# EAGLE design dcf77_clock (EAGLE 9.6.2)
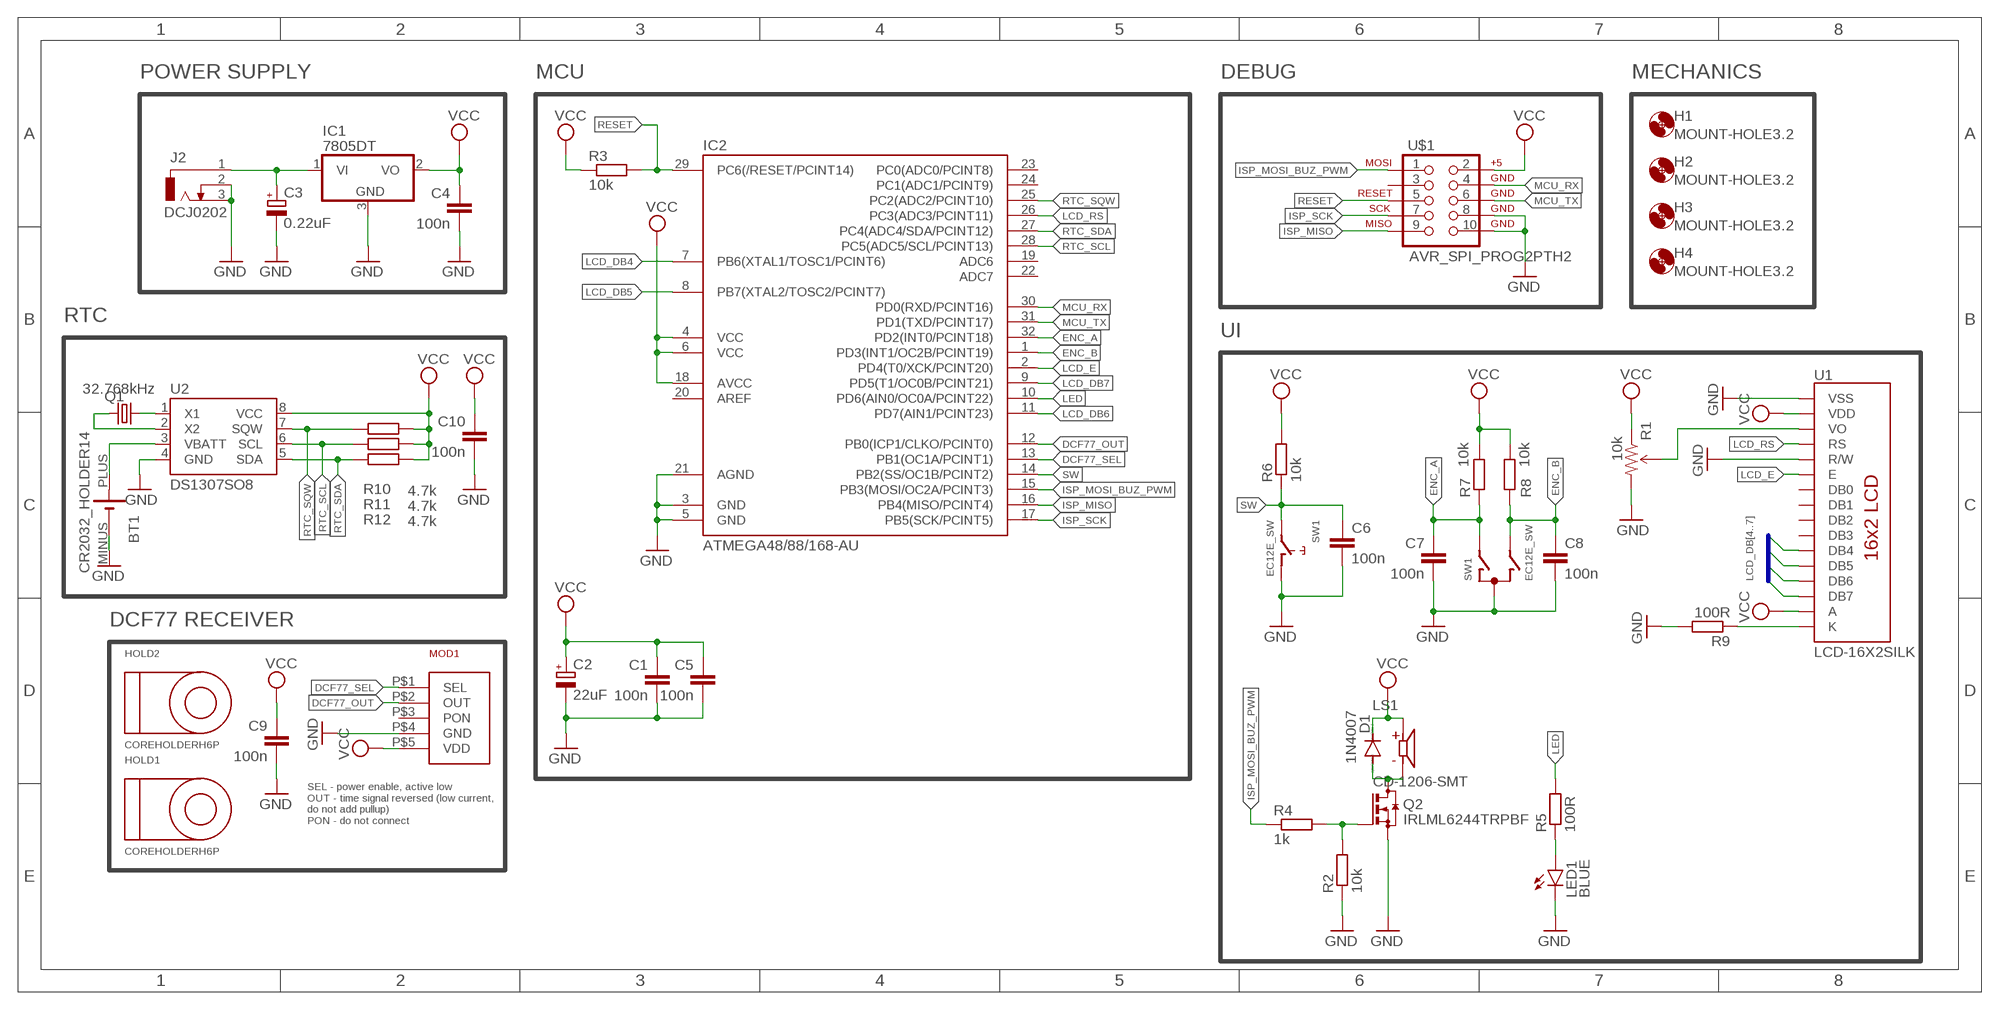
[diagram p0: schematic, sheet 1]

## Parts
BT1  CR2032_HOLDER14  [CONNFLY-DS1092-14-B6P]
C1  100n  C-EUC0805K  [C0805K]
C2  22uF  CPOL-EUUD-4X5,8  [UD-4X5,8_NICHICON]
C3  0.22uF  CPOL-EUSMCZ  [SMC_Z]
C4  100n  C-EUC0805K  [C0805K]
C5  100n  C-EUC0805K  [C0805K]
C6  100n  C-EUC0805K  [C0805K]
C7  100n  C-EUC0805K  [C0805K]
C8  100n  C-EUC0805K  [C0805K]
C9  100n  C-EUC0805K  [C0805K]
C10  100n  C-EUC0805K  [C0805K]
D1  1N4007  DIODE-SOD123  [SOD123]
H1  MOUNT-HOLE3.2  [3,2]
H2  MOUNT-HOLE3.2  [3,2]
H3  MOUNT-HOLE3.2  [3,2]
H4  MOUNT-HOLE3.2  [3,2]
HOLD1  COREHOLDERH6P  [H6P]
HOLD2  COREHOLDERH6P  [H6P]
IC1  7805DT  [TO252]
IC2  ATMEGA48/88/168-AU  [TQFP32-08]
J2  DCJ0202  [DCJ0202]
LED1  BLUE  LEDCHIP-LED0805  [CHIP-LED0805]
LS1  CD-1206-SMT  [CUI_CD-1206-SMT]
MOD1  DCF77MODULE  [DCF77MOD]
Q1  32.768kHz  CRYSTALMM20SS  [MM20SS]
Q2  IRLML6244TRPBF  [SOT23]
R1  10k  TRIMPOTPTH  [TRIM_POT_PTH]
R2  10k  R-EU_M0805  [M0805]
R3  10k  R-EU_M0805  [M0805]
R4  1k  R-EU_M0805  [M0805]
R5  100R  R-EU_M0805  [M0805]
R6  10k  R-EU_M0805  [M0805]
R7  10k  R-EU_M0805  [M0805]
R8  10k  R-EU_M0805  [M0805]
R9  100R  R-EU_M0805  [M0805]
R10  4.7k  R-EU_M0805  [M0805]
R11  4.7k  R-EU_M0805  [M0805]
R12  4.7k  R-EU_M0805  [M0805]
SW1  EC12E_SW  [ALPS_EC12E_SW]
U1  LCD-16X2SILK  [LCD-16X2]
U2  DS1307SO8  [SO08]
U$1  AVR_SPI_PROG2PTH2  [2X5-SHROUDED]

## Nets
DCF77_OUT: IC2.12(PB0(ICP1/CLKO/PCINT0)) MOD1.P$2(OUT)
DCF77_SEL: IC2.13(PB1(OC1A/PCINT1)) MOD1.P$1(SEL)
ENC_A: C7.1 IC2.32(PD2(INT0/PCINT18)) R7.1 SW1.A
ENC_B: C8.1 IC2.1(PD3(INT1/OC2B/PCINT19)) R8.1 SW1.B
GND: BT1.MINUS C1.2 C2.- C3.- C4.2 C5.2 C6.2 C7.2 C8.2 C9.2 C10.2 IC1.3(GND) IC2.3(GND) IC2.5(GND) IC2.21(AGND) J2.2 J2.3 LED1.C MOD1.P$4(GND) Q2.2(S) R1.3(CW) R2.1 R9.2 SW1.C SW1.D U1.1(VSS) U1.5(R/W) U2.4(GND) U$1.8 U$1.10
ISP_MISO: IC2.16(PB4(MISO/PCINT4)) U$1.9
ISP_MOSI_BUZ_PWM: IC2.15(PB3(MOSI/OC2A/PCINT3)) R4.1 U$1.1
ISP_SCK: IC2.17(PB5(SCK/PCINT5)) U$1.7
LCD_DB4: IC2.7(PB6(XTAL1/TOSC1/PCINT6)) U1.11(DB4)
LCD_DB5: IC2.8(PB7(XTAL2/TOSC2/PCINT7)) U1.12(DB5)
LCD_DB6: IC2.11(PD7(AIN1/PCINT23)) U1.13(DB6)
LCD_DB7: IC2.9(PD5(T1/OC0B/PCINT21)) U1.14(DB7)
LCD_E: IC2.2(PD4(T0/XCK/PCINT20)) U1.6(E)
LCD_RS: IC2.26(PC3(ADC3/PCINT11)) U1.4(RS)
LED: IC2.10(PD6(AIN0/OC0A/PCINT22)) R5.2
MCU_RX: IC2.30(PD0(RXD/PCINT16)) U$1.4
MCU_TX: IC2.31(PD1(TXD/PCINT17)) U$1.6
N$1: C3.+ IC1.1(VI) J2.1
N$2: D1.A LS1.M Q2.3(D)
N$3: Q2.1(G) R2.2 R4.2
N$4: LED1.A R5.1
N$7: R1.2(WIPER) U1.3(VO)
N$9: R9.1 U1.16(K)
N$10: Q1.1 U2.1(X1)
N$11: Q1.4 U2.2(X2)
N$12: BT1.PLUS U2.3(VBATT)
RESET: IC2.29(PC6(/RESET/PCINT14)) R3.2 U$1.5
RTC_SCL: IC2.28(PC5(ADC5/SCL/PCINT13)) R11.2 U2.6(SCL)
RTC_SDA: IC2.27(PC4(ADC4/SDA/PCINT12)) R12.2 U2.5(SDA)
RTC_SQW: IC2.25(PC2(ADC2/PCINT10)) R10.2 U2.7(SQW)
SW: C6.1 IC2.14(PB2(SS/OC1B/PCINT2)) R6.1 SW1.E
VCC: C1.1 C2.+ C4.1 C5.1 C9.1 C10.1 D1.C IC1.2(VO) IC2.4(VCC) IC2.6(VCC) IC2.18(AVCC) LS1.P MOD1.P$5(VDD) R1.1(CCW) R3.1 R6.2 R7.2 R8.2 R10.1 R11.1 R12.1 U1.2(VDD) U1.15(A) U2.8(VCC) U$1.2
Unconnected: IC2.19(ADC6) IC2.20(AREF) IC2.22(ADC7) IC2.23(PC0(ADC0/PCINT8)) IC2.24(PC1(ADC1/PCINT9)) MOD1.P$3(PON) SW1.GND1(G) SW1.GND2(G) U1.7(DB0) U1.8(DB1) U1.9(DB2) U1.10(DB3) U$1.3

## Buses
LCD_DB[4..7]

## Notes on the sheet
- POWER SUPPLY | MCU | DEBUG | MECHANICS
- RTC
- UI
- DCF77 RECEIVER
- SEL - power enable, active low
  OUT - time signal reversed (low current, 
  do not add pullup)
  PON - do not connect

## Library data of the parts
BT1 = dcf77:CR2032_HOLDER
C1 C4-C10 = rcl:C-EU: CAPACITOR, European symbol; SPICEPREFIX: C
C2 C3 = rcl:CPOL-EU: POLARIZED CAPACITOR, European symbol; SPICEPREFIX: C
D1 = diode:DIODE-: DIODE
H1-H4 = holes:MOUNT-HOLE: MOUNTING HOLE with drill center marker
HOLD1 HOLD2 = dcf77:COREHOLDER
IC1 = linear:78*: Positive VOLTAGE REGULATOR Source: http://cache.national.com/ds/LM/LM78L05.pdf http://www.fairchildsemi.com/ds/LM/LM7805.pdf
IC2 = atmega8:ATMEGA48/88/168
J2 = con-jack:DCJ0202: DC POWER JACK Source: DCJ0202.pdf; OC_FARNELL: unknown; OC_NEWARK: unknown
LED1 = led:LED: LED OSRAM: - CHIPLED LG R971, LG N971, LY N971, LG Q971, LY Q971, LO R971, LY R971 LH N974, LH R974 LS Q976, LO Q976, LY Q976 LO Q996 - Hyper CHIPLED LW Q18S LB Q993, LB Q99A, LB R99A - SideLED LS A670, LO A670, LY A670, LG A670, LP A670 LB A673, LV A673, LT A673, LW A673 LH A674 LY A675 LS A676, LA A676, LO A676, LY A676, LW A676 LS A679, LY A679, LG A679 - Hyper Micro SIDELED® LS Y876, LA Y876, LO Y876, LY Y876 LT Y87S - SmartLED LW L88C, LW L88S LB L89C, LB L89S, LG L890 LS L89K, LO L89K, LY L89K LS L896, LA L896, LO L896, LY L896 - TOPLED LS T670, LO T670, LY T670, LG T670, LP T670 LSG T670, LSP T670, LSY T670, LOP T670, LYG T670 LG T671, LOG T671, LSG T671 LB T673, LV T673, LT T673, LW T673 LH T674 LS T676, LA T676, LO T676, LY T676, LB T676, LH T676, LSB T676, LW T676 LB T67C, LV T67C, LT T67C, LS T67K, LO T67K, LY T67K, LW E67C LS E67B, LA E67B, LO E67B, LY E67B, LB E67C, LV E67C, LT E67C LW T67C LS T679, LY T679, LG T679 LS T770, LO T770, LY T770, LG T770, LP T770 LB T773, LV T773, LT T773, LW T773 LH T774 LS E675, LA E675, LY E675, LS T675 LS T776, LA T776, LO T776, LY T776, LB T776 LHGB T686 LT T68C, LB T68C - Hyper Mini TOPLED® LB M676 - Mini TOPLED Santana® LG M470 LS M47K, LO M47K, LY M47K Source: http://www.osram.convergy.de LUXEON: - LUMILED® LXK2-PW12-R00, LXK2-PW12-S00, LXK2-PW14-U00, LXK2-PW14-V00 LXK2-PM12-R00, LXK2-PM12-S00, LXK2-PM14-U00 LXK2-PE12-Q00, LXK2-PE12-R00, LXK2-PE12-S00, LXK2-PE14-T00, LXK2-PE14-U00 LXK2-PB12-K00, LXK2-PB12-L00, LXK2-PB12-M00, LXK2-PB14-N00, LXK2-PB14-P00, LXK2-PB14-Q00 LXK2-PR12-L00, LXK2-PR12-M00, LXK2-PR14-Q00, LXK2-PR14-R00 LXK2-PD12-Q00, LXK2-PD12-R00, LXK2-PD12-S00 LXK2-PH12-R00, LXK2-PH12-S00 LXK2-PL12-P00, LXK2-PL12-Q00, LXK2-PL12-R00 Source: www.luxeon.com KINGBRIGHT: KA-3528ASYC Source: www.kingbright.com
LS1 = CD-1206-SMT:CD-1206-SMT; AVAILABILITY: Unavailable; CUI_PURCHASE_URL: https://www.cui.com/product/audio/buzzers/audio-transducers/cd-1206-smt-tr?utm_source=snapeda.com&utm_medium=referral&utm_campaign=snapedaBOM; DESCRIPTION: 12 mm, 5 V, 85 dB, Surface Mount _SMT_, Sealed, Magnetic Audio Transducer Buzzer; MF: CUI Inc.; MP: CD-1206-SMT-TR; PACKAGE: 1206 CUI; PRICE: None
MOD1 = dcf77:DCF77MODULE
Q1 = crystal:CRYSTAL: CRYSTAL; OC_FARNELL: unknown; OC_NEWARK: unknown
Q2 = sosbutton:IRLML6244TRPBF: N-CHANNEL MOS FET
R1 = SparkFun:TRIMPOT
R2-R12 = rcl:R-EU_: RESISTOR, European symbol; SPICEPREFIX: R
SW1 = switch-alps:EC12E_SW: ALPS rotary Encoder EC12E series with switch; MPN: EC12E2424407; OC_FARNELL: 1520813; OC_NEWARK: 74M1068
U1 = SparkFun:LCD-16X2
U2 = SparkFun:DS1307
U$1 = SparkFun:AVR_SPI_PROG2: AVR ICSP Header This is the standard AVR In Circuit Serial Programming header. Minimal, but includes pin one indicator. Works with standard Olimex programmers. Also look for the 6-pin reduced version. Spark Fun Electronics SKU: PRT-00778

## Board
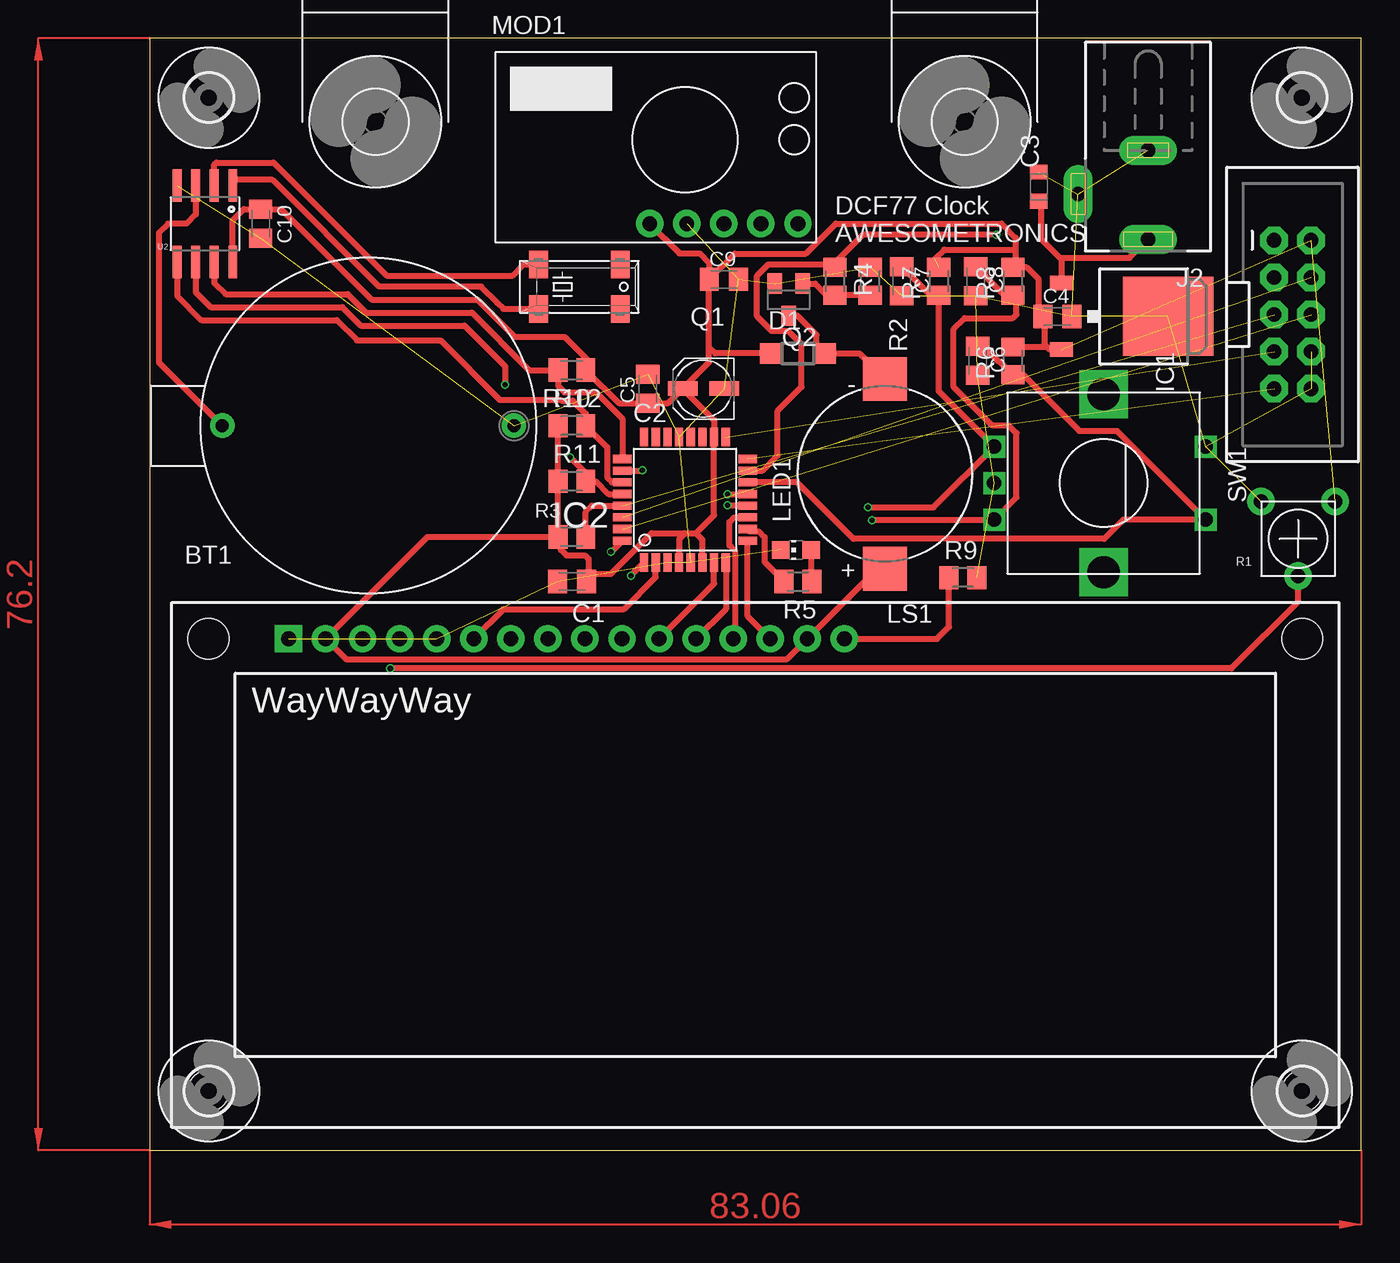
[diagram p1: board, top side]
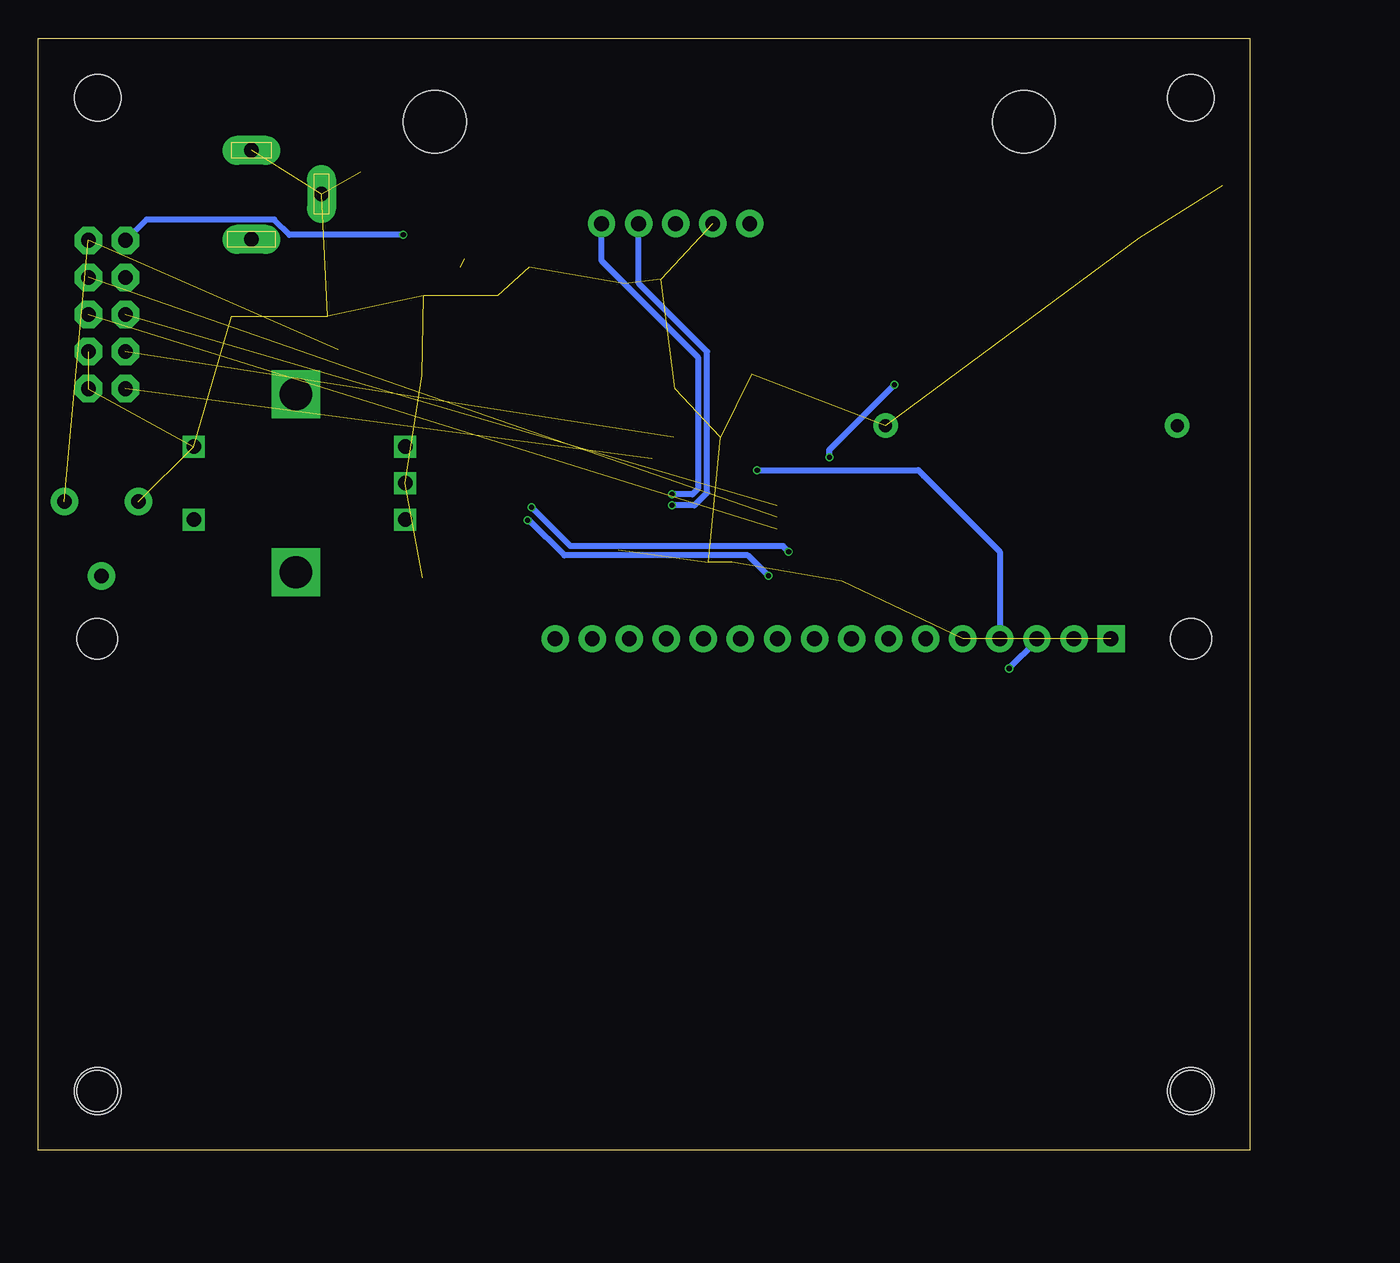
[diagram p2: board, bottom side, seen from below]

Size 83.06 x 76.2 mm. Coordinates in mm from the lower left corner, seen from the top.
Outline: 0,0 83.06,0 83.06,76.2 0,76.2 0,0
Copper layers (1*16): Top 0.035mm / dielectric 1.5mm / Bottom 0.035mm
Design rules "PCBWay_2L_152um-Track": minimum track width 6mil, minimum drill 0.3mm, track to track 6mil, track to pad 6mil, pad to pad 6mil, via to via 6mil, smd to smd 0mil, copper to edge 0.3mm, drill to drill 10mil, minimum pad ring 6mil, minimum via ring 0.1mm, stop-mask expansion 2mil, vias tented up to drill 0.45mm, thermal gap 0.2mm

### Footprints (pad centres in the part's own frame; a part is rotated, then mirrored left to right if it is on the bottom)
CONNFLY-DS1092-14-B6P = drill 0.9 pad 1.676: MINUS -10,0; PLUS 10,0
C0805K = smd 1.3 x 1.6: 1 -1,0; 2 1,0
UD-4X5,8_NICHICON = smd 2 x 1: + 1.425,0; - -1.425,0
SMC_Z = smd 1 x 1.2: + -1,0; - 1,0
SOD123 = smd 1.4 x 1.4: A 1.9,0; C -1.9,0
3,2 = hole 3.2: 0,0
H6P = hole 4.3: 0,0
TO252 = smd 1 x 1.6: 1 -2.28,-4.8; 2 2.28,-4.8 | smd 5.4 x 6.2: 3 0,2.5
TQFP32-08 = smd 1.27 x 0.559: 1 -4.293,2.8; 2 -4.293,2; 3 -4.293,1.2; 4 -4.293,0.4; 5 -4.293,-0.4; 6 -4.293,-1.2; 7 -4.293,-2; 8 -4.293,-2.8; 17 4.293,-2.8; 18 4.293,-2; 19 4.293,-1.2; 20 4.293,-0.4; 21 4.293,0.4; 22 4.293,1.2; 23 4.293,2; 24 4.293,2.8 | smd 0.559 x 1.27: 9 -2.8,-4.293; 10 -2,-4.293; 11 -1.2,-4.293; 12 -0.4,-4.293; 13 0.4,-4.293; 14 1.2,-4.293; 15 2,-4.293; 16 2.8,-4.293; 25 2.8,4.293; 26 2,4.293; 27 1.2,4.293; 28 0.4,4.293; 29 -0.4,4.293; 30 -1.2,4.293; 31 -2,4.293; 32 -2.8,4.293
DCJ0202 = drill 1 pad 2 long: 1 0,3.1; 2 4.8,0; 3 0,-3
CHIP-LED0805 = smd 1.2 x 1.2: A 0,-1.05; C 0,1.05
CUI_CD-1206-SMT = smd 3 x 3: M 0,-6.5; P 0,6.5
DCF77MOD = drill 1.016 pad 1.88: P$1 0,0; P$2 -2.54,0; P$3 -5.08,0; P$4 -7.62,0; P$5 -10.16,0
MM20SS = smd 1.27 x 1.88: 1 -2.794,-1.524; 2 2.794,-1.524; 3 2.794,1.524; 4 -2.794,1.524
SOT23 = smd 1 x 1.4: 1 -0.95,-1.1; 2 0.95,-1.1; 3 0,1.1
TRIM_POT_PTH = drill 1 pad 1.88: 1 -2.54,-2.54; 2 0,2.54; 3 2.54,-2.54
M0805 = smd 1.3 x 1.6: 1 -0.95,0; 2 0.95,0
ALPS_EC12E_SW = drill 1 square: A -2.5,-7.5; B 2.5,-7.5; C 0,-7.5; D -2.5,7; E 2.5,7 | drill 2.2 square: GND1 -6.1,0; GND2 6.1,0
LCD-16X2 = drill 1.016 pad 1.88 square: 1 -32,15.5 | drill 1.016 pad 1.88: 2 -29.46,15.5; 3 -26.92,15.5; 4 -24.38,15.5; 5 -21.84,15.5; 6 -19.3,15.5; 7 -16.76,15.5; 8 -14.22,15.5; 9 -11.68,15.5; 10 -9.14,15.5; 11 -6.6,15.5; 12 -4.06,15.5; 13 -1.52,15.5; 14 1.02,15.5; 15 3.56,15.5; 16 6.1,15.5 | hole 2.8: -37.5,15.5; -37.5,-15.5; 37.5,15.5; 37.5,-15.5
SO08 = smd 0.61 x 2.21: 1 -1.905,-2.616; 2 -0.635,-2.616; 3 0.635,-2.616; 4 1.905,-2.616; 5 1.905,2.616; 6 0.635,2.616; 7 -0.635,2.616; 8 -1.905,2.616
2X5-SHROUDED = drill 1.016 pad 1.88 octagon: 1 -1.27,5.08; 2 1.27,5.08; 3 -1.27,2.54; 4 1.27,2.54; 5 -1.27,0; 6 1.27,0; 7 -1.27,-2.54; 8 1.27,-2.54; 9 -1.27,-5.08; 10 1.27,-5.08

### Placement (x,y rotation side)
BT1  14.99,49.66 180 top
C1  28.96,38.99 180 top
C2  37.97,52.2 180 top
C3  60.96,66.04 90 top
C4  62.23,57.15 0 top
C5  34.16,52.2 90 top
C6  56.77,54.1 270 top
C7  51.56,59.56 270 top
C8  56.64,59.56 270 top
C9  39.37,59.69 0 top
C10  7.62,63.5 270 top
D1  44.45,54.61 0 top
H1  4.06,72.14 0 top
H2  4.06,4.06 0 top
H3  78.99,4.06 0 top
H4  78.99,72.14 0 top
HOLD1  15.49,70.48 270 top
HOLD2  55.88,70.48 270 top
IC1  67.31,57.15 270 top
IC2  36.7,44.58 90 top
J2  68.45,65.53 180 top
LED1  44.32,41.15 90 top
LS1  50.42,46.35 180 top
MOD1  44.45,63.5 0 top
Q1  29.46,59.18 0 top
Q2  43.81,58.29 180 top
R1  78.74,41.91 180 top
R2  49.4,59.56 270 top
R3  28.96,42.04 0 top
R4  46.99,59.56 270 top
R5  44.45,38.99 180 top
R6  59.18,54.1 90 top
R7  54.1,59.56 90 top
R8  59.18,59.56 90 top
R9  55.75,39.24 0 top
R10  28.96,53.47 180 top
R11  28.96,45.85 0 top
R12  28.96,49.66 0 top
SW1  65.41,45.72 270 top
U1  41.53,19.56 0 top
U2  3.81,63.5 180 top
U$1  78.36,57.28 0 top

### Tracks (layer width: path | path; a pad name or v marks a point on that pad's centre or on a via)
DCF77_OUT  (via drill 0.35)
  Top 0.406: v39.62,44.2 40.98,44.2 IC2.12
  Bottom 0.406: MOD1.P$2 41.91,59.44 37.22,54.74 37.22,45.08 38.09,44.2 v39.62,44.2
DCF77_SEL  (via drill 0.35)
  Top 0.406: IC2.13 40.92,44.9 40.86,44.96 v39.62,44.96
  Bottom 0.406: MOD1.P$1 44.45,60.96 37.85,54.36 37.85,45.34 38.23,44.96 v39.62,44.96
ENC_A  (via drill 0.35)
  Top 0.406: C7.1 52.89,59.24 52.89,59.23 53.7,58.42 54.1,58.42 | IC2.32 31.65,41.02 v31.62,41.02 | 54.1,58.42 54.1,52.02 SW1.A 53.75,44.06 v49.24,44.06 | 54.1,58.42 R7.1
  Bottom 0.406: v31.62,41.02 32,41.4 46.58,41.4 v49.24,44.06
ENC_B  (via drill 0.35)
  Top 0.406: C8.1 58.59,58.61 R8.1 59.44,58.36 59.44,57.28 59.18,57.02 55.88,57.02 55.12,56.26 55.12,52.32 57.78,49.66 58.93,49.66 59.44,49.15 59.44,44.75 SW1.B 49.57,43.22 v49.53,43.18 | IC2.1 33.02,39.4 v33.02,39.37
  Bottom 0.406: v33.02,39.37 34.42,40.77 46.99,40.77 49.4,43.18 v49.53,43.18
GND  (29 unrouted)
ISP_MISO  (1 unrouted)
ISP_MOSI_BUZ_PWM  (via drill 0.35)
  Top 0.406: 41.03,46.62 IC2.15 42.01,46.58 43.05,47.62 43.05,50.67 44.7,52.32 44.7,55.24 43.81,56.14 42.67,56.14 41.66,57.15 41.66,59.94 42.42,60.71 46.8,60.71 R4.1 | v58.04,62.74 58.03,62.75 48.92,62.75 46.99,60.82 R4.1 | R4.1 46.99,60.64
  Bottom 0.406: v58.04,62.74 65.84,62.74 66.89,63.79 75.66,63.79 U$1.1
ISP_SCK  (1 unrouted)
LCD_DB4
  Top 0.406: U1.11 38.7,38.83 IC2.7
LCD_DB5
  Top 0.406: IC2.8 39.5,37.09 U1.12
LCD_DB6
  Top 0.406: U1.13 40.14,35.19 40.14,41.07 39.75,41.45 39.75,43.05 40.08,43.38 IC2.11
LCD_DB7
  Top 0.406: U1.14 41,36.61 IC2.9
LCD_E
  Top 0.406: U1.6 24.25,37.08 32.51,37.08 34.7,39.27 IC2.2
LCD_RS  (via drill 0.35)
  Top 0.406: IC2.26 33.75,46.58 v33.78,46.61
  Bottom 0.406: U1.4 17.15,41.02 22.35,46.23 22.54,46.42 22.73,46.61 v33.78,46.61
LED
  Top 0.406: IC2.10 41.16,42.41 41.78,42.41 42.16,42.03 42.16,40.33 R5.2
MCU_RX  (1 unrouted)
MCU_TX  (1 unrouted)
N$1
  Top 0.406: C3.+ 61.09,64.91 61.09,62.48 62.42,61.15 | IC1.1 62.51,61.06 62.42,61.15 | 62.42,61.15 67.17,61.15 J2.1
N$2
  Top 0.406: LS1.M 48.66,54.61 D1.A 45.72,55.24 45.72,55.88 44.41,57.19 Q2.3
N$3
  Top 0.406: Q2.1 45.64,59.39 46.42,58.61 R4.2 R2.2
N$4
  Top 0.406: R5.1 45.37,39.02 LED1.A
N$7  (via drill 0.35)
  Top 0.406: R1.2 78.74,37.59 74.17,33.02 v16.51,33.02
  Bottom 0.406: v16.51,33.02 14.61,34.92 U1.3
N$9
  Top 0.406: U1.16 53.98,35.06 54.8,35.88 R9.1
N$10
  Top 0.406: U2.1 5.71,66.5 8.43,66.5 15.75,59.18 22.73,59.18 23.81,58.1 23.83,58.08 24.26,57.66 Q1.1
N$11
  Top 0.406: U2.2 4.45,67.56 4.57,67.69 8.51,67.69 16.26,59.94 24.89,59.94 25.65,60.71 Q1.4
N$12
  Top 0.406: U2.3 3.17,64.14 2.54,63.5 1.27,63.5 0.64,62.87 0.64,54.01 BT1.PLUS
RESET  (1 unrouted)
  Top 0.406: R3.2 29.91,43.75 30.33,44.18 IC2.29
RTC_SCL  (via drill 0.35)
  Top 0.406: U2.6 3.17,58.8 4.19,57.78 13.21,57.78 14.48,56.52 21.59,56.52 24.38,53.72 v24.38,52.45 | 29.97,45.85 30.61,45.85 31.48,44.98 IC2.28 | R11.2 29.97,45.85 | v28.83,47.5 29.97,46.35 29.97,45.85
  Bottom 0.406: v28.83,47.5 28.83,48.01 v24.38,52.45
RTC_SDA
  Top 0.406: U2.5 1.91,58.55 3.56,56.9 12.83,56.9 14.22,55.5 19.94,55.5 24,51.44 28.17,51.44 28.22,51.38 29.01,51.38 29.91,50.48 R12.2 31.37,48.19 31.37,46.1 31.69,45.78 IC2.27
RTC_SQW
  Top 0.406: U2.7 4.45,59.44 5.21,58.67 13.59,58.67 14.86,57.4 22.1,57.4 26.04,53.47 R10.2 28.01,52.38 28.45,51.94 30.61,51.94 32.41,50.14 IC2.25
SW
  Top 0.406: C6.1 57.18,55.1 58.23,54.05 58.29,54.05 R6.1 59.89,53.15 63.73,49.31 66.32,49.31 SW1.E 66.76,43.22 65.45,41.91 48.26,41.91 44.39,45.78 IC2.14
VCC  (3 unrouted)
  Top 0.406: U2.8 5.71,63.75 6.46,64.5 C10.1 9.03,64.5 15.24,58.29 22.48,58.29 25.02,55.75 28.45,55.75 30.35,53.85 29.97,53.47 R10.1 | 29.72,53.47 R10.1 | IC2.6 37.9,41.85 37.47,42.29 | 36.7,42.29 37.47,42.29 | IC2.4 36.3,41.89 36.7,42.29 | 37.47,42.29 38.7,43.53 IC2.18 38.7,50.04 C2.+ | R10.1 32.18,51.2 C5.1 35.55,51.2 C2.+ | C2.+ 38.37,54.02 38.37,55.03 | 38.37,55.03 C9.1 | R3.1 R11.1 R12.1 | C1.1 30.1,38.99 30.1,39.5 | 30.1,39.5 31.62,39.5 34.42,42.29 36.7,42.29 | R3.1 28.19,41.85 28.19,41.15 28.57,40.77 29.84,40.77 30.1,40.51 30.1,39.5 | R3.1 19.05,42.04 U1.2 13.47,33.66 43.69,33.66 U1.15 49.89,39.85 LS1.P | 61.47,55.12 61.34,55.24 61.34,57.04 C4.1 60.96,57.42 60.96,59.69 60.14,60.51 59.31,60.51 | 61.47,55.12 61.72,54.87 IC1.2 | C9.1 40.12,61.44 44.99,61.44 47.04,63.5 58.42,63.5 59.37,62.55 59.37,61.72 | D1.C 38.8,54.61 38.37,55.03 | R7.2 54.17,60.45 54.29,60.57 | 59.37,61.72 54.48,61.72 53.85,61.09 | R6.2 61.4,55.05 61.47,55.12 | MOD1.P$5 36.32,61.47 37.72,61.47 38.37,60.82 C9.1 | 59.31,60.51 R8.2 | 59.37,61.72 59.37,60.57 59.31,60.51
(copper drawn outside any net)
  shapes: Top area x4

### Text on the board
tPlace: DCF77 Clock / AWESOMETRONICS
tNames: WayWayWay